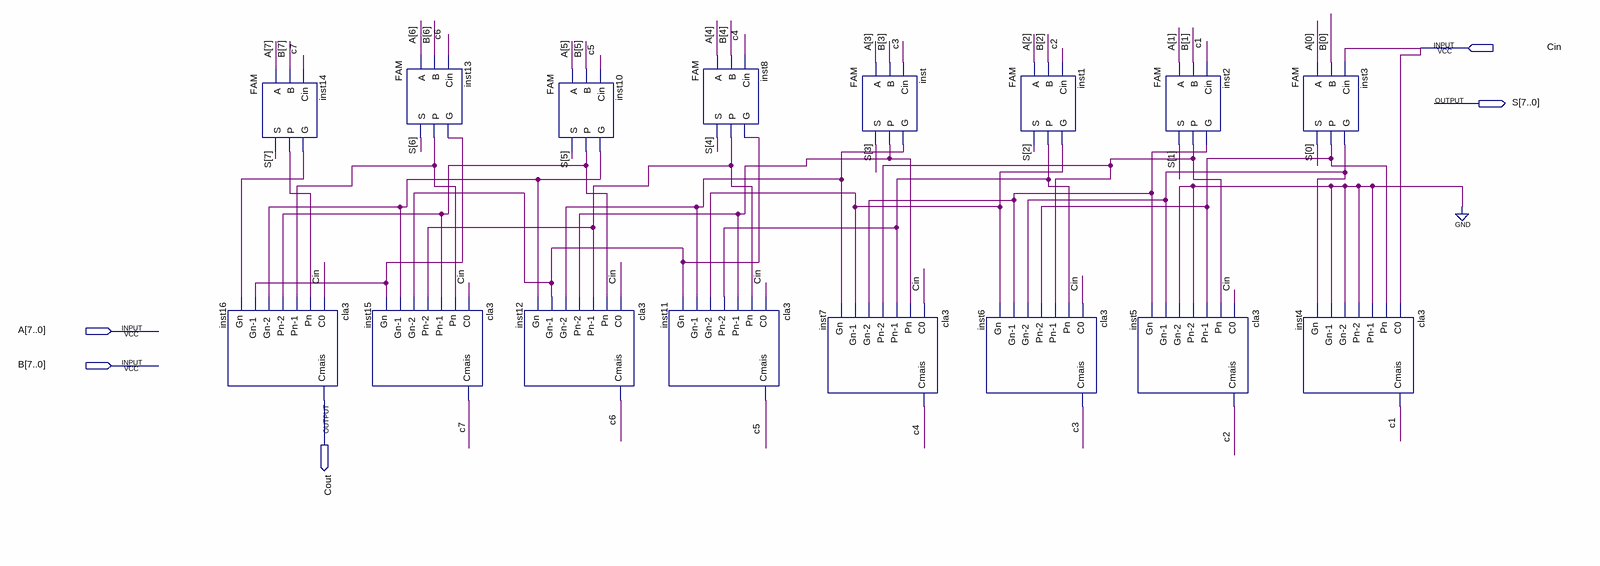
[diagram p0: schematic sheet]
// Quartus schematic cla8.bdf as structural Verilog: 16 symbols, 5 pins
module cla8 (
  input  Cin,
  input  [7:0] A,
  input  [7:0] B,
  output [7:0] S,
  output Cout
);

  wire c1, c2, c3, c4, c5, c6, c7, inst1_g, inst1_p, inst2_g, inst2_p, inst3_g, inst3_p, inst8_g, inst8_p,
       inst10_g, inst10_p, inst13_g, inst13_p, inst14_g, inst14_p, inst_g, inst_p;

  cla3 inst16 (
    .C0(Cin), .Pn(inst14_p), .\Pn-1 (inst13_p), .\Pn-2 (inst10_p), .\Gn-2 (inst10_g), .\Gn-1 (inst13_g),
    .Gn(inst14_g), .Cmais(Cout));
  FAM inst14 (.A(A[7]), .B(B[7]), .Cin(c7), .S(S[7]), .P(inst14_p), .G(inst14_g));
  FAM inst13 (.A(A[6]), .B(B[6]), .Cin(c6), .S(S[6]), .P(inst13_p), .G(inst13_g));
  cla3 inst15 (
    .C0(Cin), .Pn(inst13_p), .\Pn-1 (inst10_p), .\Pn-2 (inst8_p), .\Gn-2 (inst8_g), .\Gn-1 (inst10_g),
    .Gn(inst13_g), .Cmais(c7));
  cla3 inst12 (
    .C0(Cin), .Pn(inst10_p), .\Pn-1 (inst8_p), .\Pn-2 (inst_p), .\Gn-2 (inst_g), .\Gn-1 (inst8_g),
    .Gn(inst10_g), .Cmais(c6));
  FAM inst10 (.A(A[5]), .B(B[5]), .Cin(c5), .S(S[5]), .P(inst10_p), .G(inst10_g));
  cla3 inst11 (
    .C0(Cin), .Pn(inst8_p), .\Pn-1 (inst_p), .\Pn-2 (inst1_p), .\Gn-2 (inst1_g), .\Gn-1 (inst_g),
    .Gn(inst8_g), .Cmais(c5));
  FAM inst8 (.A(A[4]), .B(B[4]), .Cin(c4), .S(S[4]), .P(inst8_p), .G(inst8_g));
  cla3 inst7 (
    .C0(Cin), .Pn(inst_p), .\Pn-1 (inst1_p), .\Pn-2 (inst2_p), .\Gn-2 (inst2_g), .\Gn-1 (inst1_g),
    .Gn(inst_g), .Cmais(c4));
  FAM inst (.A(A[3]), .B(B[3]), .Cin(c3), .S(S[3]), .P(inst_p), .G(inst_g));
  FAM inst1 (.A(A[2]), .B(B[2]), .Cin(c2), .S(S[2]), .P(inst1_p), .G(inst1_g));
  cla3 inst6 (
    .C0(Cin), .Pn(inst1_p), .\Pn-1 (inst2_p), .\Pn-2 (inst3_p), .\Gn-2 (inst3_g), .\Gn-1 (inst2_g),
    .Gn(inst1_g), .Cmais(c3));
  FAM inst2 (.A(A[1]), .B(B[1]), .Cin(c1), .S(S[1]), .P(inst2_p), .G(inst2_g));
  cla3 inst5 (
    .C0(Cin), .Pn(inst2_p), .\Pn-1 (inst3_p), .\Pn-2 (1'b0), .\Gn-2 (1'b0), .\Gn-1 (inst3_g), .Gn(inst2_g),
    .Cmais(c2));
  FAM inst3 (.A(A[0]), .B(B[0]), .Cin(Cin), .S(S[0]), .P(inst3_p), .G(inst3_g));
  cla3 inst4 (
    .C0(Cin), .Pn(inst3_p), .\Pn-1 (1'b0), .\Pn-2 (1'b0), .\Gn-2 (1'b0), .\Gn-1 (1'b0), .Gn(inst3_g),
    .Cmais(c1));
endmodule
